# Altium project Arduino.PrjPcb
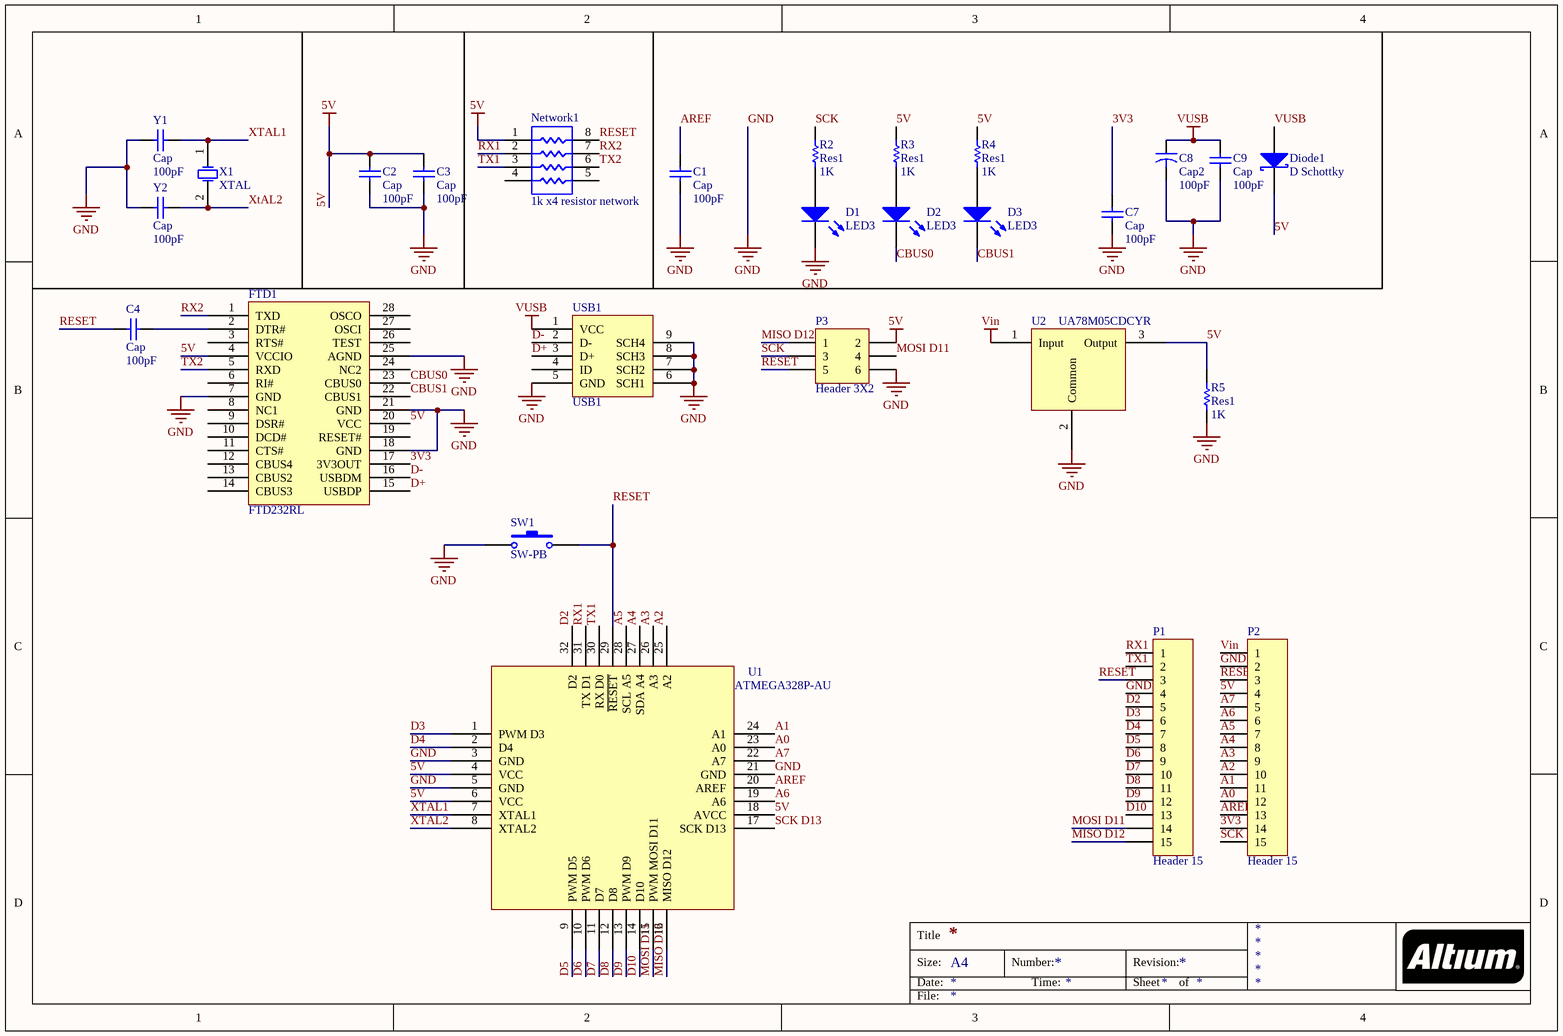
[diagram p0: arduino.SchDoc]
1 sheet, 27 parts. Net scope: global (net labels, ports and power ports of the same name join across sheets).
Board file: arduino.PcbDoc

## Sheet arduino.SchDoc
size A4

### Parts
C1  Cap  value 100pF  [C0805]
C2  Cap  value 100pF  [C0805]
C3  Cap  value 100pF  [C0805]
C4  Cap  value 100pF  [C0805]
C7  Cap  value 100pF  [C0805]
C8  Cap2  value 100pF  [C0805]
C9  Cap  value 100pF  [C0805]
D1  LED3  [3.5X2.8X1.9]
D2  LED3  [3.5X2.8X1.9]
D3  LED3  [3.5X2.8X1.9]
Diode1  D Schottky  [SMB]
FTD1  FTD232RL  [SOP68P780X200-28N]
Network1  1k x4 resistor network  [4x resistor network]
P1  Header 15  [HDR1X15]
P2  Header 15  [HDR1X15]
P3  Header 3X2  [HDR2X3]
R2  Res1  value 1K  [6-0805_M]
R3  Res1  value 1K  [6-0805_M]
R4  Res1  value 1K  [6-0805_M]
R5  Res1  value 1K  [6-0805_M]
SW1  SW-PB  [SPST]
U1  ATMEGA328P-AU  [TQFP80P900X900X120-32N]
U2  UA78M05CDCYR  [SOT230P700X180-4N]
USB1  USB1  [micro usb]
X1  XTAL  [ABLS-16.000MHZ-B4-T]
Y1  Cap  value 100pF  [C0805]
Y2  Cap  value 100pF  [C0805]

### Nets
5V: C2.2 C3.2 Diode1.2(K) FTD1.4(VCCIO) FTD1.20(VCC) Network1.1 P2.4 P3.2 R3.2 R4.2 R5.2 U1.4(VCC) U1.6(VCC) U1.18(AVCC) U2.3(Output)
GND: C1.2 C2.1 C3.1 C7.1 C8.2 C9.2 D1.2(K) FTD1.7(GND) FTD1.18(GND) FTD1.21(GND) FTD1.25(AGND) P1.4 P2.2 P3.6 R5.1 SW1.1 U1.3(GND) U1.5(GND) U1.21(GND) U2.2(Common) USB1.5(GND) USB1.6(SCH1) USB1.7(SCH2) USB1.8(SCH3) USB1.9(SCH4) Y1.1 Y2.1
Vin: P2.1 U2.1(Input)
VUSB: C8.1 C9.1 Diode1.1(A) USB1.1(VCC)
3V3: C7.2 FTD1.17(3V3OUT) P2.14
A0: P2.12 U1.23(A0)
A1: P2.11 U1.24(A1)
A2: P2.10 U1.25(A2)
A3: P2.9 U1.26(A3)
A4: P2.8 U1.27(SDA_A4)
A5: P2.7 U1.28(SCL_A5)
A6: P2.6 U1.19(A6)
A7: P2.5 U1.22(A7)
AREF: C1.1 P2.13 U1.20(AREF)
CBUS0: D2.2(K) FTD1.23(CBUS0)
CBUS1: D3.2(K) FTD1.22(CBUS1)
D2: P1.5 U1.32(D2)
D3: P1.6 U1.1(PWM_D3)
D4: P1.7 U1.2(D4)
D5: P1.8 U1.9(PWM_D5)
D6: P1.9 U1.10(PWM_D6)
D7: P1.10 U1.11(D7)
D8: P1.11 U1.12(D8)
D9: P1.12 U1.13(PWM_D9)
D10: P1.13 U1.14(D10)
D+: FTD1.15(USBDP) USB1.3(D+)
D-: FTD1.16(USBDM) USB1.2(D-)
MISO D12: P1.15 P3.1 U1.16(MISO_D12)
MOSI D11: P1.14 P3.4 U1.15(PWM_MOSI_D11)
RESET: C4.1 Network1.8 P1.3 P2.3 P3.5 SW1.2 U1.29(~{RESET})
RX1: Network1.2 P1.1 U1.31(TX_D1)
RX2: FTD1.1(TXD) Network1.7
SCK: P3.3 R2.2
SCK D13: P2.15 U1.17(SCK_D13)
TX1: Network1.3 P1.2 U1.30(RX_D0)
TX2: FTD1.5(RXD) Network1.6
XTAL1: U1.7(XTAL1) X1.1(OSC1) Y1.2
XtAL2: U1.8(XTAL2) X1.2(OSC2) Y2.2
NetC4_2: C4.2 FTD1.2(DTR#)
NetD1_1: D1.1(A) R2.1
NetD2_1: D2.1(A) R3.1
NetD3_1: D3.1(A) R4.1

Not connected (* = marked no-connect by the designer): FTD1 3(RTS#) 6(RI#) 8(NC1) 9(DSR#) 10(DCD#) 11(CTS#) 12(CBUS4) 13(CBUS2) 14(CBUS3) 19(RESET#) 24(NC2) 26(TEST) 27(OSCI) 28(OSCO); Network1 4 5; USB1 4(ID)

### Notes on the sheet
- Title
- Size:
- Date:
- A4
- Number:
- Time:
- Revision:
- Sheet
- of
- File:

### Library data of the parts
C1-C4 C7 C9 Y1 Y2 = Cap: Capacitor; Published: 8-Jun-2000; LatestRevisionDate: 17-Jul-2002; LatestRevisionNote: Re-released for DXP Platform.; PackageReference: RAD-0.3; Publisher: Altium Limited; PackageDescription: Radial Cap, Thru-Hole; 2 Leads; 0.3 in Pin Spacing
C8 = Cap2: Capacitor; Published: 23-Sep-2002; PackageReference: CAPR5-4X5; Publisher: Altium Limited; PackageDescription: Capacitor; 2 Leads
D1-D3 = LED3: Typical BLUE SiC LED; Published: 8-Jun-2000; LatestRevisionDate: 17-Dec-2003; LatestRevisionNote: PCB Footprint replaced.; DatasheetVersion: 16-Apr-2002; PackageVersion: 16-Apr-2002; PackageReference: 3.5X2.8X1.9; Publisher: Altium Limited; PackageDescription: SM LED; 2 C-Bend Leads; Body 3.5 x 2.8 x 1.9 mm, inc leads (LxWxH typ)
Diode1 = D Schottky: Schottky Diode; Published: 8-Jun-2000; LatestRevisionDate: 17-Jul-2002; LatestRevisionNote: Re-released for DXP Platform.; PackageReference: SMB; Publisher: Altium Limited; PackageDescription: DO-214-AA/SMB; 2 C-Bend Leads; Body 5.3 x 3.6 mm, inc. leads (LxW); Code_JEDEC: DO-214-AA
FTD1 = FTD232RL: FTDI Chip FT232RL Universal Asynchronous Receiver & Transmitter 3MBd, 28-Pin, SSOP; Created by: Andrew Ang; Date created: 15/11/2016; Datasheet URL: http://www.ftdichip.com/Support/Documents/DataSheets/ICs/DS_FT232R.pdf; Digikey link: http://www.digikey.co.nz/product-detail/en/FT232RL-REEL/768-1007-1-ND/1836402?WT.srch=1&mkwid=sgrXOlHls&pcrid=64697050346&pkw=_cat%3Adigikey.co.nz&pmt=b&pdv=c
P1 P2 = Header 15: Header, 15-Pin; LatestRevisionDate: 17-Jul-2002; LatestRevisionNote: Re-released for DXP Platform.; Publisher: Altium Limited
P3 = Header 3X2: Header, 3-Pin, Dual row; LatestRevisionDate: 17-Jul-2002; LatestRevisionNote: Re-released for DXP Platform.; Publisher: Altium Limited
R2-R5 = Res1: Resistor; Published: 8-Jun-2000; LatestRevisionDate: 17-Jul-2002; LatestRevisionNote: Re-released for DXP Platform.; PackageReference: AXIAL-0.3; Publisher: Altium Limited; PackageDescription: Axial Device, Thru-Hole; 2 Leads; 0.3 in Pin Spacing
SW1 = SW-PB: Switch; Published: 24-Mar-1999; LatestRevisionDate: 17-Jul-2002; LatestRevisionNote: Re-released for DXP Platform.; PackageReference: SPST-2; Publisher: Altium Limited; PackageDescription: Switch; 2 Leads
U1 = ATMEGA328P-AU: Atmel ATMEGA328P-AU, 8bit AVR Microcontroller, 20MHz, 1 kB, 32 kB Flash, 32-Pin TQFP; Created by: Andrew Ang; date created: 15/11/2016; datasheet url: http://www.atmel.com/Images/Atmel-8271-8-bit-AVR-Microcontroller-ATmega48A-48PA-88A-88PA-168A-168PA-328-328P_datasheet_Complete.pdf
U2 = UA78M05CDCYR: n Linear Voltage Regulator IC Positive Fixed 1 Output 5V 500mA SOT-223-4; Created by: Andrew Ang; Date created: 16/11/2016; Datasheet URL: http://www.ti.com/lit/ds/symlink/ua78m05.pdf; Digikey URL: http://www.digikey.co.nz/product-detail/en/texas-instruments/UA78M05CDCYR/296-12290-1-ND/416584
USB1 = Component_1
X1 = XTAL: Crystal Oscillator; Published: 8-Jun-2000; LatestRevisionDate: 17-Jul-2002; LatestRevisionNote: Re-released for DXP Platform.; PackageReference: R38; Publisher: Altium Limited; PackageDescription: Crystal, Thru-Hole; 2 Leads; Body 3.1 x 8.2 mm (Dia.xH)